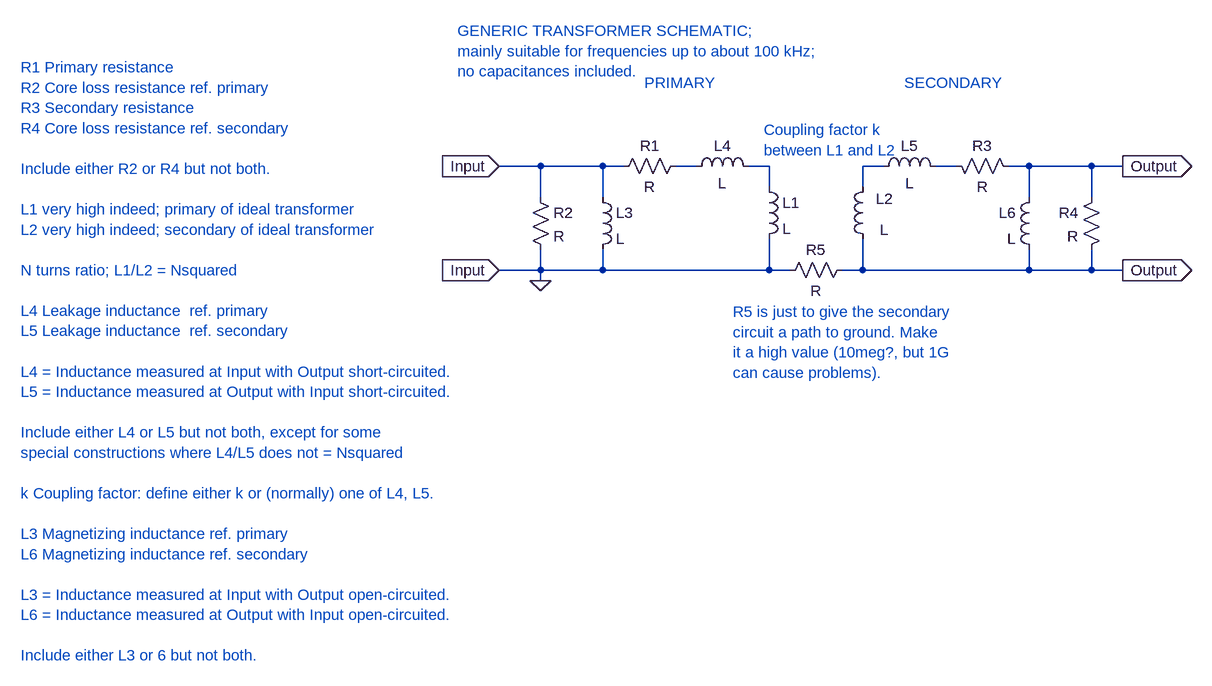
[diagram p0: schematic Generic transformer.asc]
Generic transformer.asc, the LTspice schematic file:
Version 4
SHEET 1 880 680
WIRE -384 -800 -448 -800
WIRE -288 -800 -384 -800
WIRE -256 -800 -288 -800
WIRE -144 -800 -176 -800
WIRE -32 -800 -64 -800
WIRE 144 -800 112 -800
WIRE 256 -800 224 -800
WIRE 368 -800 336 -800
WIRE 464 -800 368 -800
WIRE 512 -800 464 -800
WIRE -32 -768 -32 -800
WIRE 112 -768 112 -800
WIRE -384 -752 -384 -800
WIRE -288 -752 -288 -800
WIRE 368 -752 368 -800
WIRE 464 -752 464 -800
WIRE -384 -640 -384 -672
WIRE -384 -640 -448 -640
WIRE -288 -640 -288 -672
WIRE -288 -640 -384 -640
WIRE -32 -640 -32 -688
WIRE -32 -640 -288 -640
WIRE 0 -640 -32 -640
WIRE 112 -640 112 -688
WIRE 112 -640 80 -640
WIRE 368 -640 368 -672
WIRE 368 -640 112 -640
WIRE 464 -640 464 -672
WIRE 464 -640 368 -640
WIRE 512 -640 464 -640
WIRE -384 -624 -384 -640
FLAG -384 -624 0
FLAG -448 -800 Input
IOPIN -448 -800 In
FLAG -448 -640 Input
IOPIN -448 -640 In
FLAG 512 -800 Output
IOPIN 512 -800 Out
FLAG 512 -640 Output
IOPIN 512 -640 Out
SYMBOL ind -48 -784 R0
SYMATTR InstName L1
SYMBOL ind -160 -784 R270
WINDOW 0 32 56 VTop 2
WINDOW 3 5 56 VBottom 2
SYMATTR InstName L4
SYMBOL ind -304 -768 R0
SYMATTR InstName L3
SYMBOL res -272 -784 R270
WINDOW 0 32 56 VTop 2
WINDOW 3 0 56 VBottom 2
SYMATTR InstName R1
SYMBOL res -400 -768 R0
SYMATTR InstName R2
SYMBOL ind 128 -784 M0
WINDOW 0 -31 34 Left 2
WINDOW 3 -24 82 Left 2
SYMATTR InstName L2
SYMBOL ind 240 -784 M270
WINDOW 0 32 56 VTop 2
WINDOW 3 5 56 VBottom 2
SYMATTR InstName L5
SYMBOL ind 384 -768 M0
SYMATTR InstName L6
SYMBOL res 352 -784 M270
WINDOW 0 32 56 VTop 2
WINDOW 3 0 56 VBottom 2
SYMATTR InstName R3
SYMBOL res 480 -768 M0
SYMATTR InstName R4
SYMBOL res -16 -624 R270
WINDOW 0 32 56 VTop 2
WINDOW 3 0 56 VBottom 2
SYMATTR InstName R5
TEXT -224 -928 Left 2 ;PRIMARY
TEXT 176 -928 Left 2 ;SECONDARY
TEXT -40 -856 Left 2 ;Coupling factor k\nbetween L1 and L2
TEXT -88 -576 Left 2 ;R5 is just to give the secondary \ncircuit a path to ground. Make\nit a high value (10meg?, but 1G\ncan cause problems).
TEXT -1184 -952 Left 2 ;R1 Primary resistance\nR2 Core loss resistance ref. primary\nR3 Secondary resistance\nR4 Core loss resistance ref. secondary\n \nInclude either R2 or R4 but not both.\n \nL1 very high indeed; primary of ideal transformer\nL2 very high indeed; secondary of ideal transformer\n \nN turns ratio; L1/L2 = Nsquared\n \nL4 Leakage inductance  ref. primary\nL5 Leakage inductance  ref. secondary\n \nL4 = Inductance measured at Input with Output short-circuited.\nL5 = Inductance measured at Output with Input short-circuited.\n \nInclude either L4 or L5 but not both, except for some\nspecial constructions where L4/L5 does not = Nsquared\n \nk Coupling factor: define either k or (normally) one of L4, L5. \n \nL3 Magnetizing inductance ref. primary\nL6 Magnetizing inductance ref. secondary\n \nL3 = Inductance measured at Input with Output open-circuited.\nL6 = Inductance measured at Output with Input open-circuited.\n \nInclude either L3 or 6 but not both.
TEXT -512 -1008 Left 2 ;GENERIC TRANSFORMER SCHEMATIC;\nmainly suitable for frequencies up to about 100 kHz;\nno capacitances included.

The netlist it stands for:
* Generic transformer.asc
L1 N002 0 L
L4 N001 N002 L
L3 0 0 L
R1 0 N001 R
R2 0 0 R
L2 N003 Output L
L5 N004 N003 L
L6 Output Output L
R3 Output N004 R
R4 Output Output R
R5 0 Output R
* PRIMARY
* SECONDARY
* Coupling factor k
* between L1 and L2
* R5 is just to give the secondary
* circuit a path to ground. Make
* it a high value (10meg?, but 1G
* can cause problems).
* R1 Primary resistance
* R2 Core loss resistance ref. primary
* R3 Secondary resistance
* R4 Core loss resistance ref. secondary
* Include either R2 or R4 but not both.
* L1 very high indeed; primary of ideal transformer
* L2 very high indeed; secondary of ideal transformer
* N turns ratio; L1/L2 = Nsquared
* L4 Leakage inductance  ref. primary
* L5 Leakage inductance  ref. secondary
* L4 = Inductance measured at Input with Output short-circuited.
* L5 = Inductance measured at Output with Input short-circuited.
* Include either L4 or L5 but not both, except for some
* special constructions where L4/L5 does not = Nsquared
* k Coupling factor: define either k or (normally) one of L4, L5.
* L3 Magnetizing inductance ref. primary
* L6 Magnetizing inductance ref. secondary
* L3 = Inductance measured at Input with Output open-circuited.
* L6 = Inductance measured at Output with Input open-circuited.
* Include either L3 or 6 but not both.
* GENERIC TRANSFORMER SCHEMATIC;
* mainly suitable for frequencies up to about 100 kHz;
* no capacitances included.
.backanno
.end